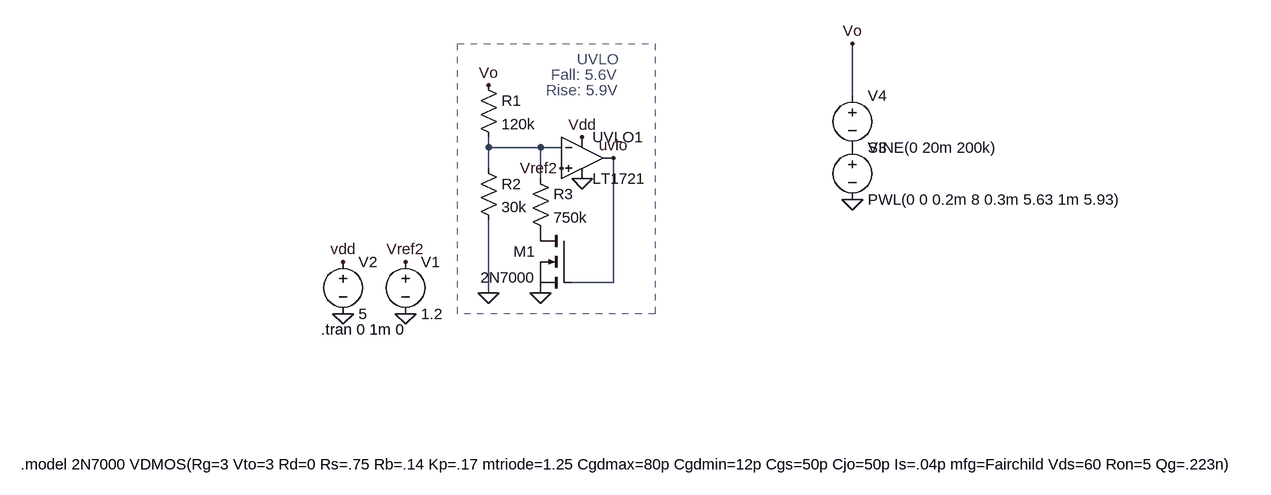
[diagram p0: schematic uvlo_problematico.asc]
uvlo_problematico.asc, the LTspice schematic file:
Version 4
SHEET 1 1504 680
WIRE 720 80 720 0
WIRE 160 160 160 144
WIRE 240 160 160 160
WIRE 272 160 240 160
WIRE 352 176 336 176
WIRE 160 192 160 160
WIRE 240 208 240 160
WIRE 352 368 352 176
WIRE 352 368 288 368
WIRE 160 384 160 272
FLAG 304 208 0
FLAG 304 144 Vdd
FLAG 272 192 Vref2
FLAG 160 64 Vo
FLAG 160 384 0
FLAG 352 176 uvlo
FLAG 240 384 0
FLAG 32 416 0
FLAG 32 336 Vref2
FLAG -64 416 0
FLAG -64 336 vdd
FLAG 720 240 0
FLAG 720 0 Vo
SYMBOL Comparators\\LT1721 304 112 R0
SYMATTR InstName UVLO1
SYMBOL res 144 48 R0
SYMATTR InstName R1
SYMATTR Value 120k
SYMBOL res 144 176 R0
SYMATTR InstName R2
SYMATTR Value 30k
SYMBOL res 224 192 R0
SYMATTR InstName R3
SYMATTR Value 750k
SYMBOL nmos 288 288 M0
SYMATTR InstName M1
SYMATTR Value 2N7000
SYMBOL voltage 32 320 R0
WINDOW 123 0 0 Left 0
WINDOW 39 0 0 Left 0
SYMATTR InstName V1
SYMATTR Value 1.2
SYMBOL voltage -64 320 R0
WINDOW 123 0 0 Left 0
WINDOW 39 0 0 Left 0
SYMATTR InstName V2
SYMATTR Value 5
SYMBOL voltage 720 144 R0
WINDOW 123 0 0 Left 0
WINDOW 39 0 0 Left 0
SYMATTR InstName V3
SYMATTR Value PWL(0 0 0.2m 8 0.3m 5.63 1m 5.93)
SYMBOL voltage 720 64 R0
WINDOW 123 0 0 Left 0
WINDOW 39 0 0 Left 0
SYMATTR InstName V4
SYMATTR Value SINE(0 20m 200k)
TEXT 296 24 Left 2 ;UVLO
TEXT 256 48 Left 2 ;Fall: 5.6V
TEXT 248 72 Left 2 ;Rise: 5.9V
TEXT -98 440 Left 2 !.tran 0 1m 0
TEXT -560 648 Left 2 !.model 2N7000 VDMOS(Rg=3 Vto=3 Rd=0 Rs=.75 Rb=.14 Kp=.17 mtriode=1.25 Cgdmax=80p Cgdmin=12p Cgs=50p Cjo=50p Is=.04p mfg=Fairchild Vds=60 Ron=5 Qg=.223n)
LINE Normal 112 0 416 0 2
LINE Normal 112 416 112 0 2
LINE Normal 416 416 112 416 2
LINE Normal 416 0 416 416 2

The netlist it stands for:
* uvlo_problematico.asc
XUVLO1 Vref2 N001 Vdd 0 uvlo LT1720  ; LT1721, pins In+ In- V+ V- OUT
R1 Vo N001 120k
R2 N001 0 30k
R3 N001 P001 750k
M1 P001 uvlo 0 0 2N7000
V1 Vref2 0 1.2
V2 Vdd 0 5
V3 P002 0 PWL(0 0 0.2m 8 0.3m 5.63 1m 5.93)
V4 Vo P002 SINE(0 20m 200k)
.model NMOS NMOS
.model PMOS PMOS
.lib standard.mos
* UVLO
* Fall: 5.6V
* Rise: 5.9V
.tran 0 1m 0
.model 2N7000 VDMOS(Rg=3 Vto=3 Rd=0 Rs=.75 Rb=.14 Kp=.17 mtriode=1.25 Cgdmax=80p Cgdmin=12p Cgs=50p Cjo=50p Is=.04p mfg=Fairchild Vds=60 Ron=5 Qg=.223n)
.lib LTC.lib
.backanno
.end